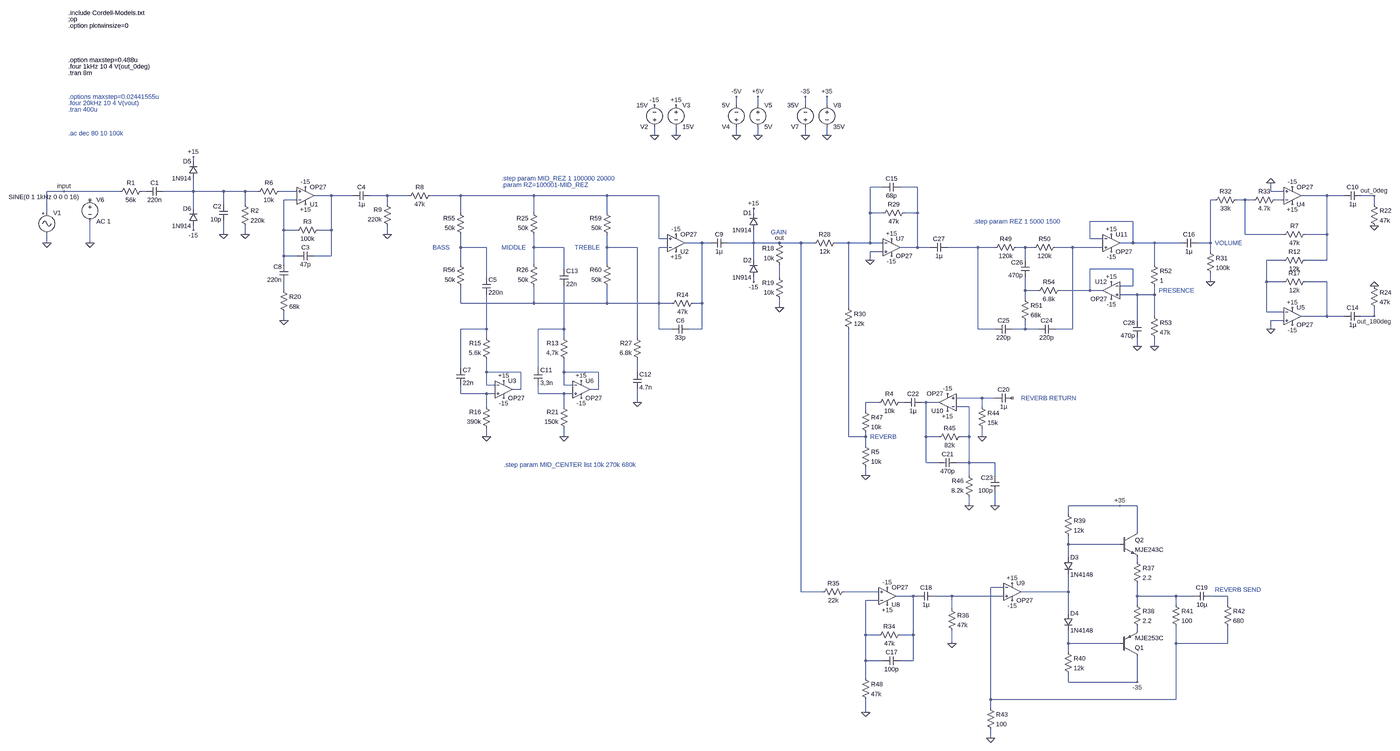
[diagram p0: schematic jazz_preamp.asc, whole sheet]
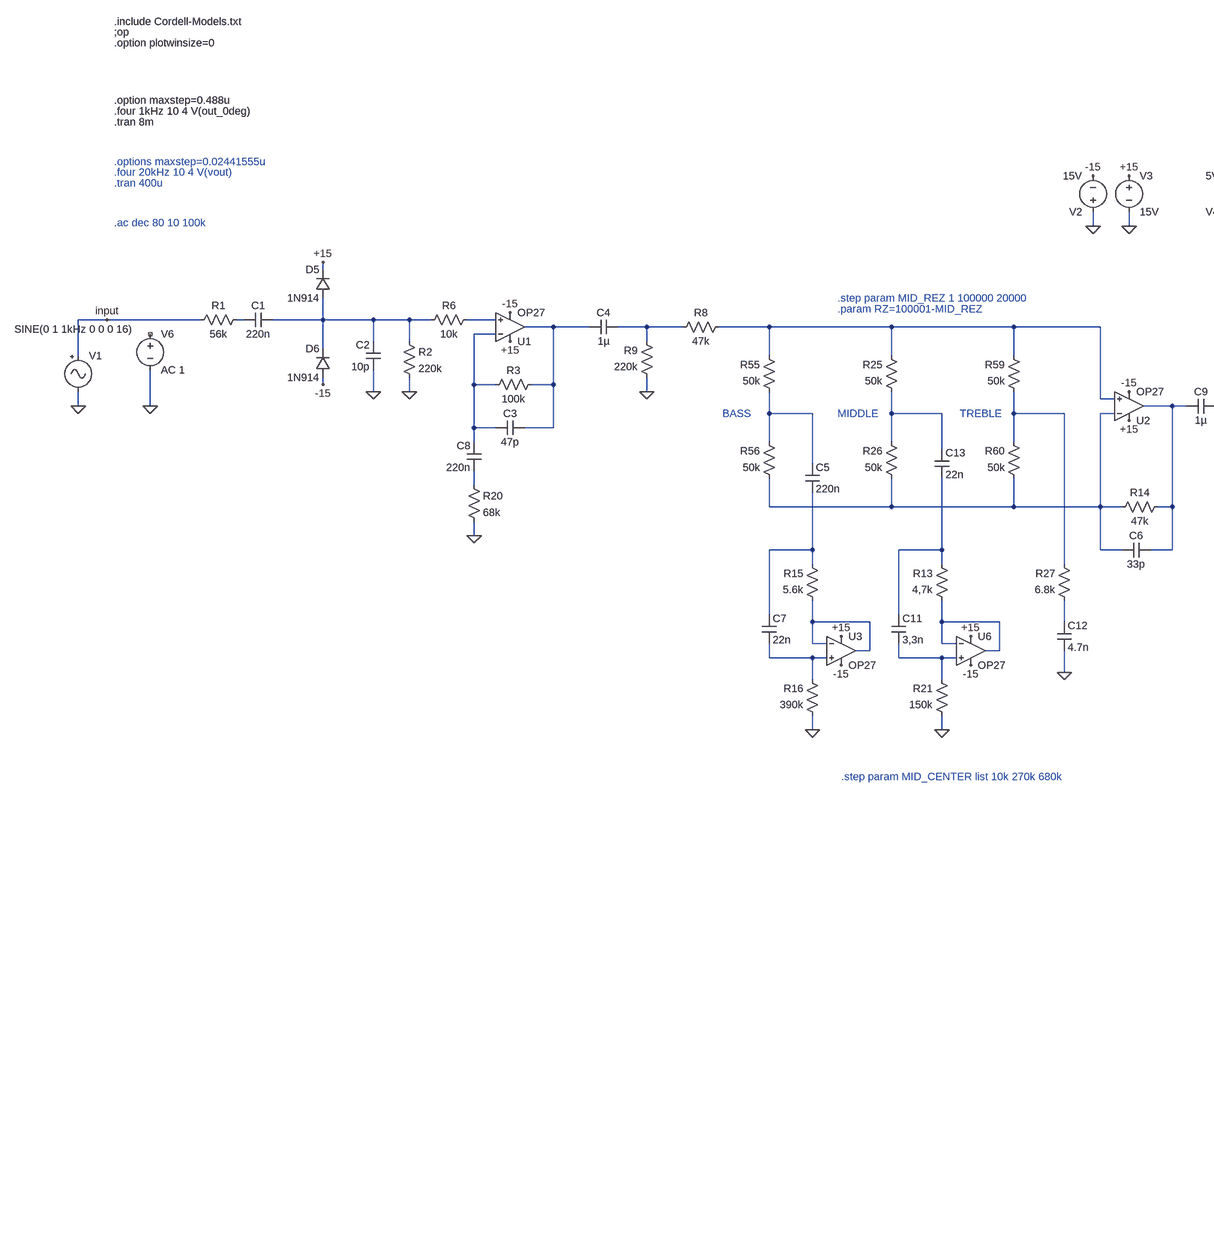
[diagram p1: schematic jazz_preamp.asc, part, row 1 of 1, column 1 of 2]
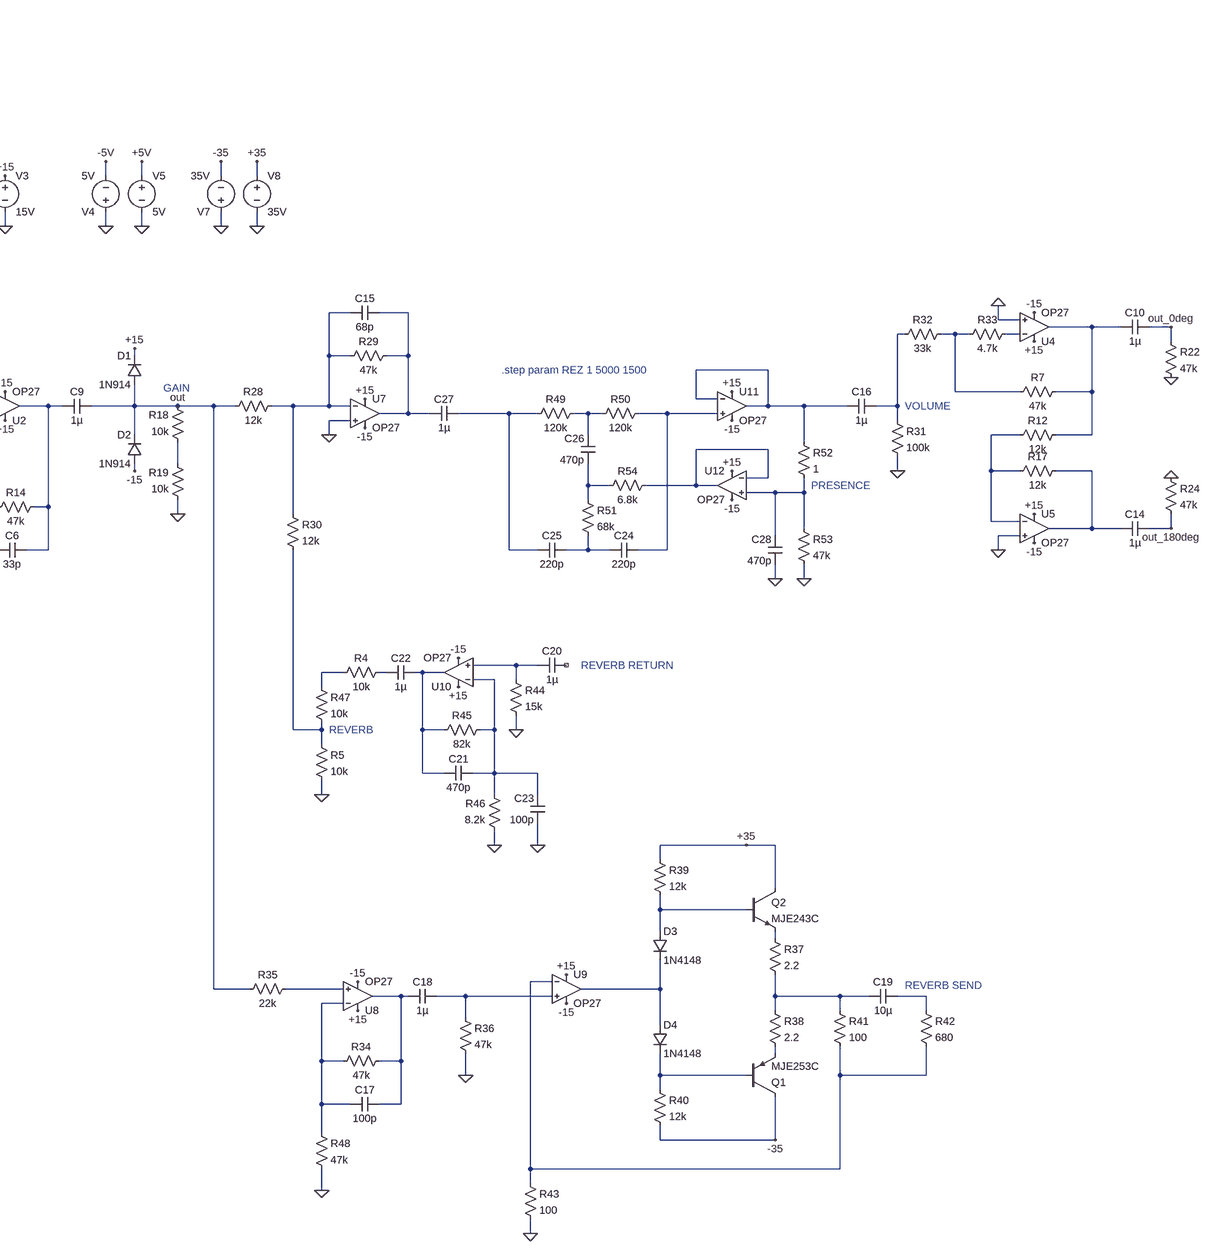
[diagram p2: schematic jazz_preamp.asc, part, row 1 of 1, column 2 of 2]
jazz_preamp.asc, the LTspice schematic file:
Version 4
SHEET 1 4264 1972
WIRE 1392 -656 1392 -688
WIRE 1472 -656 1472 -688
WIRE 1648 -656 1648 -688
WIRE 1728 -656 1728 -688
WIRE 1088 -544 1088 -576
WIRE 1168 -544 1168 -576
WIRE 1392 -544 1392 -576
WIRE 1472 -544 1472 -576
WIRE 1648 -544 1648 -576
WIRE 1728 -544 1728 -576
WIRE -624 -448 -624 -464
WIRE 1936 -352 1888 -352
WIRE 2064 -352 2000 -352
WIRE -1104 -336 -1168 -336
WIRE -896 -336 -1104 -336
WIRE -800 -336 -816 -336
WIRE -624 -336 -624 -384
WIRE -624 -336 -736 -336
WIRE -512 -336 -624 -336
WIRE -432 -336 -512 -336
WIRE -384 -336 -432 -336
WIRE -240 -336 -304 -336
WIRE 3376 -336 3376 -368
WIRE 3424 -336 3376 -336
WIRE -112 -320 -176 -320
WIRE -32 -320 -112 -320
WIRE 96 -320 32 -320
WIRE 176 -320 96 -320
WIRE 368 -320 256 -320
WIRE 640 -320 368 -320
WIRE 912 -320 640 -320
WIRE 1104 -320 912 -320
WIRE 3584 -320 3488 -320
WIRE 3648 -320 3584 -320
WIRE 3760 -320 3712 -320
WIRE -240 -304 -288 -304
WIRE 3168 -304 3152 -304
WIRE 3280 -304 3248 -304
WIRE 3312 -304 3280 -304
WIRE 3424 -304 3392 -304
WIRE -512 -288 -512 -336
WIRE -432 -288 -432 -336
WIRE 96 -288 96 -320
WIRE 3760 -288 3760 -320
WIRE -624 -272 -624 -336
WIRE -1168 -256 -1168 -336
WIRE 368 -256 368 -320
WIRE 640 -256 640 -320
WIRE 912 -256 912 -320
WIRE 1456 -256 1456 -272
WIRE 1888 -256 1888 -352
WIRE 1936 -256 1888 -256
WIRE 2064 -256 2064 -352
WIRE 2064 -256 2016 -256
WIRE 2864 -224 2704 -224
WIRE -624 -192 -624 -208
WIRE -288 -192 -288 -304
WIRE -240 -192 -288 -192
WIRE -112 -192 -112 -320
WIRE -112 -192 -160 -192
WIRE -512 -176 -512 -224
WIRE -432 -176 -432 -208
WIRE 96 -176 96 -208
WIRE 3280 -176 3280 -304
WIRE 3424 -176 3280 -176
WIRE 3584 -176 3584 -320
WIRE 3584 -176 3504 -176
WIRE 1104 -160 1104 -320
WIRE 1136 -160 1104 -160
WIRE 2704 -160 2704 -224
WIRE 2752 -160 2704 -160
WIRE -1168 -144 -1168 -176
WIRE -1008 -144 -1008 -224
WIRE 1264 -144 1200 -144
WIRE 1296 -144 1264 -144
WIRE 1456 -144 1456 -192
WIRE 1456 -144 1360 -144
WIRE 1552 -144 1456 -144
WIRE 1632 -144 1552 -144
WIRE 1680 -144 1632 -144
WIRE 1808 -144 1760 -144
WIRE 1888 -144 1888 -256
WIRE 1888 -144 1808 -144
WIRE 1936 -144 1888 -144
WIRE 2864 -144 2864 -224
WIRE 2864 -144 2816 -144
WIRE 2944 -144 2864 -144
WIRE 3040 -144 2944 -144
WIRE 3152 -144 3152 -304
WIRE 3152 -144 3104 -144
WIRE 368 -128 368 -176
WIRE 464 -128 368 -128
WIRE 640 -128 640 -176
WIRE 752 -128 640 -128
WIRE 912 -128 912 -176
WIRE 1024 -128 912 -128
WIRE 1136 -128 1104 -128
WIRE 2064 -128 2064 -256
WIRE 2064 -128 2000 -128
WIRE 2112 -128 2064 -128
WIRE 2288 -128 2176 -128
WIRE 2352 -128 2288 -128
WIRE 2464 -128 2432 -128
WIRE 2496 -128 2464 -128
WIRE 2640 -128 2576 -128
WIRE 2752 -128 2640 -128
WIRE 1936 -112 1888 -112
WIRE 3152 -112 3152 -144
WIRE -288 -96 -288 -192
WIRE -240 -96 -288 -96
WIRE -112 -96 -112 -192
WIRE -112 -96 -176 -96
WIRE 1456 -80 1456 -144
WIRE 1888 -80 1888 -112
WIRE 2464 -80 2464 -128
WIRE 3424 -80 3360 -80
WIRE 3584 -80 3584 -176
WIRE 3584 -80 3504 -80
WIRE -288 -64 -288 -96
WIRE 368 -64 368 -128
WIRE 640 -64 640 -128
WIRE 912 -64 912 -128
WIRE 2944 -64 2944 -144
WIRE 752 -48 752 -128
WIRE 2864 -48 2704 -48
WIRE 464 -16 464 -128
WIRE 1552 -16 1552 -64
WIRE 1456 0 1456 -16
WIRE 3152 0 3152 -32
WIRE 3360 0 3360 -80
WIRE 3424 0 3360 0
WIRE 3584 0 3504 0
WIRE 2864 16 2864 -48
WIRE 2864 16 2816 16
WIRE -288 32 -288 0
WIRE 2464 32 2464 -16
WIRE 2512 32 2464 32
WIRE 2704 32 2704 -48
WIRE 2704 32 2592 32
WIRE 2752 32 2704 32
WIRE 2880 48 2816 48
WIRE 2944 48 2944 16
WIRE 2944 48 2880 48
WIRE 2464 64 2464 32
WIRE 368 80 368 16
WIRE 640 80 640 16
WIRE 640 80 368 80
WIRE 912 80 912 16
WIRE 912 80 640 80
WIRE 1104 80 1104 -128
WIRE 1104 80 912 80
WIRE 1152 80 1104 80
WIRE 1264 80 1264 -144
WIRE 1264 80 1232 80
WIRE 1552 96 1552 64
WIRE 1808 96 1808 -144
WIRE 3360 112 3360 0
WIRE 3424 112 3360 112
WIRE 2944 128 2944 48
WIRE 3584 128 3584 0
WIRE 3584 128 3488 128
WIRE 3648 128 3584 128
WIRE 3760 128 3760 96
WIRE 3760 128 3712 128
WIRE -288 144 -288 112
WIRE 2880 144 2880 48
WIRE 3424 144 3376 144
WIRE 464 176 464 48
WIRE 464 176 368 176
WIRE 752 176 752 16
WIRE 752 176 656 176
WIRE 1104 176 1104 80
WIRE 1152 176 1104 176
WIRE 1264 176 1264 80
WIRE 1264 176 1216 176
WIRE 2288 176 2288 -128
WIRE 2352 176 2288 176
WIRE 2464 176 2464 144
WIRE 2464 176 2416 176
WIRE 2512 176 2464 176
WIRE 2640 176 2640 -128
WIRE 2640 176 2576 176
WIRE 3376 176 3376 144
WIRE 464 208 464 176
WIRE 752 208 752 176
WIRE 1024 208 1024 -128
WIRE 2880 240 2880 208
WIRE 2944 240 2944 208
WIRE 368 320 368 176
WIRE 656 320 656 176
WIRE 464 336 464 288
WIRE 592 336 464 336
WIRE 752 336 752 288
WIRE 880 336 752 336
WIRE 1024 336 1024 288
WIRE 464 384 464 336
WIRE 496 384 464 384
WIRE 752 384 752 336
WIRE 784 384 752 384
WIRE 592 400 592 336
WIRE 592 400 560 400
WIRE 880 400 880 336
WIRE 880 400 848 400
WIRE 368 416 368 384
WIRE 464 416 368 416
WIRE 496 416 464 416
WIRE 656 416 656 384
WIRE 752 416 656 416
WIRE 784 416 752 416
WIRE 2304 432 2208 432
WIRE 2352 432 2304 432
WIRE 1024 448 1024 400
WIRE 1920 448 1872 448
WIRE 2016 448 2000 448
WIRE 2096 448 2080 448
WIRE 2144 448 2096 448
WIRE 464 464 464 416
WIRE 752 464 752 416
WIRE 2256 464 2208 464
WIRE 2304 464 2304 432
WIRE 1872 480 1872 448
WIRE 464 576 464 544
WIRE 752 576 752 544
WIRE 1808 576 1808 176
WIRE 1872 576 1872 560
WIRE 1872 576 1808 576
WIRE 2096 576 2096 448
WIRE 2144 576 2096 576
WIRE 2256 576 2256 464
WIRE 2256 576 2224 576
WIRE 2304 576 2304 544
WIRE 1872 608 1872 576
WIRE 2096 672 2096 576
WIRE 2144 672 2096 672
WIRE 2256 672 2256 576
WIRE 2256 672 2208 672
WIRE 2352 672 2256 672
WIRE 1872 720 1872 688
WIRE 2256 720 2256 672
WIRE 2352 720 2352 672
WIRE 2256 832 2256 800
WIRE 2352 832 2352 784
WIRE 2816 832 2624 832
WIRE 2880 832 2816 832
WIRE 2624 864 2624 832
WIRE 2880 880 2880 832
WIRE 2880 928 2880 880
WIRE 2624 976 2624 944
WIRE 2816 976 2624 976
WIRE 2624 1024 2624 976
WIRE 2880 1040 2880 1024
WIRE 2384 1136 2336 1136
WIRE 1632 1152 1632 -144
WIRE 1712 1152 1632 1152
WIRE 1920 1152 1792 1152
WIRE 2624 1152 2624 1088
WIRE 2624 1152 2448 1152
WIRE 2048 1168 1984 1168
WIRE 2064 1168 2048 1168
WIRE 2192 1168 2128 1168
WIRE 2384 1168 2192 1168
WIRE 2880 1168 2880 1120
WIRE 3024 1168 2880 1168
WIRE 3088 1168 3024 1168
WIRE 3216 1168 3152 1168
WIRE 1920 1184 1872 1184
WIRE 2880 1200 2880 1168
WIRE 3024 1200 3024 1168
WIRE 3216 1200 3216 1168
WIRE 2192 1216 2192 1168
WIRE 2624 1232 2624 1152
WIRE 2880 1296 2880 1280
WIRE 1872 1312 1872 1184
WIRE 1920 1312 1872 1312
WIRE 2048 1312 2048 1168
WIRE 2048 1312 2000 1312
WIRE 2192 1344 2192 1296
WIRE 2624 1344 2624 1296
WIRE 2816 1344 2624 1344
WIRE 3024 1344 3024 1280
WIRE 3216 1344 3216 1280
WIRE 3216 1344 3024 1344
WIRE 2624 1376 2624 1344
WIRE 1872 1408 1872 1312
WIRE 1936 1408 1872 1408
WIRE 2048 1408 2048 1312
WIRE 2048 1408 2000 1408
WIRE 1872 1472 1872 1408
WIRE 2624 1488 2624 1456
WIRE 2880 1488 2880 1392
WIRE 2880 1488 2624 1488
WIRE 2336 1552 2336 1136
WIRE 3024 1552 3024 1344
WIRE 3024 1552 2336 1552
WIRE 2336 1584 2336 1552
WIRE 1872 1600 1872 1552
WIRE 2336 1696 2336 1664
FLAG -1168 -144 0
FLAG -432 -176 0
FLAG -512 -176 0
FLAG 1552 96 0
FLAG -288 144 0
FLAG 1088 -544 0
FLAG 1168 -544 0
FLAG -1008 -144 0
FLAG 1552 -144 out
FLAG 96 -176 0
FLAG 464 576 0
FLAG 1024 448 0
FLAG 1088 -656 -15
FLAG 1168 -656 +15
FLAG 528 368 +15
FLAG 1168 -112 +15
FLAG 528 432 -15
FLAG 1168 -176 -15
FLAG 752 576 0
FLAG 816 368 +15
FLAG 816 432 -15
FLAG 1472 -544 0
FLAG 1392 -544 0
FLAG 1472 -688 +5V
FLAG 1392 -688 -5V
FLAG 3456 -288 +15
FLAG 3456 -352 -15
FLAG 3376 -368 0
FLAG 3456 96 +15
FLAG 3456 160 -15
FLAG 3376 176 0
FLAG 3760 -208 0
FLAG 3760 16 0
FLAG 1968 -160 +15
FLAG 1968 -96 -15
FLAG 1888 -80 0
FLAG 3152 0 0
FLAG -208 -288 +15
FLAG -208 -352 -15
FLAG 1952 1200 +15
FLAG 1952 1136 -15
FLAG 2192 1344 0
FLAG 2416 1184 -15
FLAG 2416 1120 +15
FLAG 2336 1696 0
FLAG 1728 -544 0
FLAG 1648 -544 0
FLAG 1648 -688 -35
FLAG 1728 -688 +35
FLAG 2816 832 +35
FLAG 2880 1488 -35
FLAG 2176 480 +15
FLAG 2176 416 -15
FLAG 2304 576 0
FLAG 2256 832 0
FLAG 1872 720 0
FLAG 2352 832 0
FLAG 1872 1600 0
FLAG 2784 -176 +15
FLAG 2784 0 +15
FLAG 2784 64 -15
FLAG 2784 -112 -15
FLAG 2944 240 0
FLAG -624 -464 +15
FLAG -624 -192 -15
FLAG 1456 -272 +15
FLAG 1456 0 -15
FLAG 2880 240 0
FLAG 3760 128 out_180deg
FLAG 3760 -320 out_0deg
FLAG -1104 -336 input
DATAFLAG 2880 880 "Ic(Q2)"
SYMBOL Misc\\signal -1168 -272 R0
WINDOW 3 -142 -43 Left 2
WINDOW 123 0 0 Left 2
WINDOW 39 0 0 Left 2
SYMATTR Value SINE(0 1 1kHz 0 0 0 16)
SYMATTR InstName V1
SYMBOL res -912 -320 R270
WINDOW 0 32 56 VTop 2
WINDOW 3 0 56 VBottom 2
SYMATTR InstName R1
SYMATTR Value 56k
SYMBOL Opamps\\OP27 -208 -256 M180
SYMATTR InstName U1
SYMBOL cap -736 -352 R90
WINDOW 0 0 32 VBottom 2
WINDOW 3 32 32 VTop 2
SYMATTR InstName C1
SYMATTR Value 220n
SYMBOL cap -496 -224 R180
WINDOW 0 24 56 Left 2
WINDOW 3 24 8 Left 2
SYMATTR InstName C2
SYMATTR Value 10p
SYMBOL res -448 -304 R0
SYMATTR InstName R2
SYMATTR Value 220k
SYMBOL res -144 -208 R90
WINDOW 0 0 56 VBottom 2
WINDOW 3 32 56 VTop 2
SYMATTR InstName R3
SYMATTR Value 100k
SYMBOL cap -176 -112 R90
WINDOW 0 0 32 VBottom 2
WINDOW 3 32 32 VTop 2
SYMATTR InstName C3
SYMATTR Value 47p
SYMBOL cap 32 -336 R90
WINDOW 0 0 32 VBottom 2
WINDOW 3 32 32 VTop 2
SYMATTR InstName C4
SYMATTR Value 1µ
SYMBOL cap 448 -16 R0
SYMATTR InstName C5
SYMATTR Value 220n
SYMBOL cap 1360 -160 R90
WINDOW 0 0 32 VBottom 2
WINDOW 3 32 32 VTop 2
SYMATTR InstName C9
SYMATTR Value 1µ
SYMBOL res 1568 -48 R180
WINDOW 0 36 76 Left 2
WINDOW 3 36 40 Left 2
SYMATTR InstName R18
SYMATTR Value 10k
SYMBOL res 1568 80 R180
WINDOW 0 36 76 Left 2
WINDOW 3 36 40 Left 2
SYMATTR InstName R19
SYMATTR Value 10k
SYMBOL res -304 16 R0
SYMATTR InstName R20
SYMATTR Value 68k
SYMBOL voltage 1088 -560 R180
WINDOW 123 0 0 Left 2
WINDOW 39 0 0 Left 2
SYMATTR InstName V2
SYMATTR Value 15V
SYMBOL voltage 1168 -672 R0
WINDOW 123 0 0 Left 2
WINDOW 39 0 0 Left 2
SYMATTR InstName V3
SYMATTR Value 15V
SYMBOL voltage -1008 -320 R0
WINDOW 123 0 0 Left 2
WINDOW 39 0 0 Left 2
SYMATTR InstName V6
SYMATTR Value AC 1
SYMBOL res 272 -336 R90
WINDOW 0 0 56 VBottom 2
WINDOW 3 32 56 VTop 2
SYMATTR InstName R8
SYMATTR Value 47k
SYMBOL res 112 -192 R180
WINDOW 0 36 76 Left 2
WINDOW 3 36 40 Left 2
SYMATTR InstName R9
SYMATTR Value 220k
SYMBOL res 1248 64 R90
WINDOW 0 0 56 VBottom 2
WINDOW 3 32 56 VTop 2
SYMATTR InstName R14
SYMATTR Value 47k
SYMBOL cap 1216 160 R90
WINDOW 0 0 32 VBottom 2
WINDOW 3 32 32 VTop 2
SYMATTR InstName C6
SYMATTR Value 33p
SYMBOL Opamps\\OP27 1168 -80 M180
SYMATTR InstName U2
SYMBOL Opamps\\OP27 528 336 R0
SYMATTR InstName U3
SYMBOL res 480 304 R180
WINDOW 0 36 76 Left 2
WINDOW 3 36 40 Left 2
SYMATTR InstName R15
SYMATTR Value 5.6k
SYMBOL res 480 560 R180
WINDOW 0 36 76 Left 2
WINDOW 3 36 40 Left 2
SYMATTR InstName R16
SYMATTR Value 390k
SYMBOL cap 352 320 R0
SYMATTR InstName C7
SYMATTR Value 22n
SYMBOL res 1040 304 R180
WINDOW 0 36 76 Left 2
WINDOW 3 36 40 Left 2
SYMATTR InstName R27
SYMATTR Value 6.8k
SYMBOL cap 1008 336 R0
SYMATTR InstName C12
SYMATTR Value 4.7n
SYMBOL Opamps\\OP27 816 336 R0
SYMATTR InstName U6
SYMBOL res 768 304 R180
WINDOW 0 36 76 Left 2
WINDOW 3 36 40 Left 2
SYMATTR InstName R13
SYMATTR Value 4,7k
SYMBOL res 768 560 R180
WINDOW 0 36 76 Left 2
WINDOW 3 36 40 Left 2
SYMATTR InstName R21
SYMATTR Value 150k
SYMBOL cap 640 320 R0
SYMATTR InstName C11
SYMATTR Value 3,3n
SYMBOL cap 736 -48 R0
SYMATTR InstName C13
SYMATTR Value 22n
SYMBOL res -288 -352 R90
WINDOW 0 0 56 VBottom 2
WINDOW 3 32 56 VTop 2
SYMATTR InstName R6
SYMATTR Value 10k
SYMBOL cap -272 0 R180
WINDOW 0 24 56 Left 2
WINDOW 3 24 8 Left 2
SYMATTR InstName C8
SYMATTR Value 220n
SYMBOL voltage 1392 -560 R180
WINDOW 123 0 0 Left 2
WINDOW 39 0 0 Left 2
SYMATTR InstName V4
SYMATTR Value 5V
SYMBOL voltage 1472 -672 R0
WINDOW 123 0 0 Left 2
WINDOW 39 0 0 Left 2
SYMATTR InstName V5
SYMATTR Value 5V
SYMBOL Opamps\\OP27 3456 -256 M180
SYMATTR InstName U4
SYMBOL res 3408 -160 R270
WINDOW 0 32 56 VTop 2
WINDOW 3 0 56 VBottom 2
SYMATTR InstName R7
SYMATTR Value 47k
SYMBOL Opamps\\OP27 3456 64 R0
SYMATTR InstName U5
SYMBOL res 3408 -64 R270
WINDOW 0 32 56 VTop 2
WINDOW 3 0 56 VBottom 2
SYMATTR InstName R12
SYMATTR Value 12k
SYMBOL res 3408 16 R270
WINDOW 0 32 56 VTop 2
WINDOW 3 0 56 VBottom 2
SYMATTR InstName R17
SYMATTR Value 12k
SYMBOL cap 3712 -336 R90
WINDOW 0 0 32 VBottom 2
WINDOW 3 32 32 VTop 2
SYMATTR InstName C10
SYMATTR Value 1µ
SYMBOL cap 3712 112 R90
WINDOW 0 0 32 VBottom 2
WINDOW 3 32 32 VTop 2
SYMATTR InstName C14
SYMATTR Value 1µ
SYMBOL res 3744 -304 R0
SYMATTR InstName R22
SYMATTR Value 47k
SYMBOL res 3744 0 R0
SYMATTR InstName R24
SYMATTR Value 47k
SYMBOL res 1664 -128 R270
WINDOW 0 32 56 VTop 2
WINDOW 3 0 56 VBottom 2
SYMATTR InstName R28
SYMATTR Value 12k
SYMBOL Opamps\\OP27 1968 -192 R0
SYMATTR InstName U7
SYMBOL res 1920 -240 R270
WINDOW 0 32 56 VTop 2
WINDOW 3 0 56 VBottom 2
SYMATTR InstName R29
SYMATTR Value 47k
SYMBOL cap 2000 -368 R90
WINDOW 0 0 32 VBottom 2
WINDOW 3 32 32 VTop 2
SYMATTR InstName C15
SYMATTR Value 68p
SYMBOL res 1792 80 R0
SYMATTR InstName R30
SYMATTR Value 12k
SYMBOL cap 3104 -160 R90
WINDOW 0 0 32 VBottom 2
WINDOW 3 32 32 VTop 2
SYMATTR InstName C16
SYMATTR Value 1µ
SYMBOL res 3136 -128 R0
SYMATTR InstName R31
SYMATTR Value 100k
SYMBOL res 3152 -288 R270
WINDOW 0 32 56 VTop 2
WINDOW 3 0 56 VBottom 2
SYMATTR InstName R32
SYMATTR Value 33k
SYMBOL res 3296 -288 R270
WINDOW 0 32 56 VTop 2
WINDOW 3 0 56 VBottom 2
SYMATTR InstName R33
SYMATTR Value 4.7k
SYMBOL Opamps\\OP27 1952 1232 M180
SYMATTR InstName U8
SYMBOL res 2016 1296 R90
WINDOW 0 0 56 VBottom 2
WINDOW 3 32 56 VTop 2
SYMATTR InstName R34
SYMATTR Value 47k
SYMBOL cap 1936 1424 R270
WINDOW 0 32 32 VTop 2
WINDOW 3 0 32 VBottom 2
SYMATTR InstName C17
SYMATTR Value 100p
SYMBOL Opamps\\OP27 2416 1088 R0
SYMATTR InstName U9
SYMBOL res 1696 1168 R270
WINDOW 0 32 56 VTop 2
WINDOW 3 0 56 VBottom 2
SYMATTR InstName R35
SYMATTR Value 22k
SYMBOL cap 2128 1152 R90
WINDOW 0 0 32 VBottom 2
WINDOW 3 32 32 VTop 2
SYMATTR InstName C18
SYMATTR Value 1µ
SYMBOL res 2176 1200 R0
SYMATTR InstName R36
SYMATTR Value 47k
SYMBOL diode 2608 1024 R0
SYMATTR InstName D3
SYMATTR Value 1N4148
SYMBOL diode 2608 1232 R0
SYMATTR InstName D4
SYMATTR Value 1N4148
SYMBOL pnp 2816 1392 M180
SYMATTR InstName Q1
SYMATTR Value MJE253C
SYMBOL npn 2816 928 R0
SYMATTR InstName Q2
SYMATTR Value MJE243C
SYMBOL res 2864 1024 R0
SYMATTR InstName R37
SYMATTR Value 2.2
SYMBOL res 2864 1184 R0
SYMATTR InstName R38
SYMATTR Value 2.2
SYMBOL res 2608 848 R0
SYMATTR InstName R39
SYMATTR Value 12k
SYMBOL res 2608 1360 R0
SYMATTR InstName R40
SYMATTR Value 12k
SYMBOL res 3008 1184 R0
SYMATTR InstName R41
SYMATTR Value 100
SYMBOL cap 3152 1152 R90
WINDOW 0 0 32 VBottom 2
WINDOW 3 32 32 VTop 2
SYMATTR InstName C19
SYMATTR Value 10µ
SYMBOL res 3200 1184 R0
SYMATTR InstName R42
SYMATTR Value 680
SYMBOL res 2320 1568 R0
SYMATTR InstName R43
SYMATTR Value 100
SYMBOL voltage 1648 -560 R180
WINDOW 123 0 0 Left 2
WINDOW 39 0 0 Left 2
SYMATTR InstName V7
SYMATTR Value 35V
SYMBOL voltage 1728 -672 R0
WINDOW 123 0 0 Left 2
WINDOW 39 0 0 Left 2
SYMATTR InstName V8
SYMATTR Value 35V
SYMBOL Opamps\\OP27 2176 512 R180
SYMATTR InstName U10
SYMBOL res 2288 448 R0
SYMATTR InstName R44
SYMATTR Value 15k
SYMBOL cap 2416 416 R90
WINDOW 0 0 32 VBottom 2
WINDOW 3 32 32 VTop 2
SYMATTR InstName C20
SYMATTR Value 1µ
SYMBOL res 2240 560 R90
WINDOW 0 0 56 VBottom 2
WINDOW 3 32 56 VTop 2
SYMATTR InstName R45
SYMATTR Value 82k
SYMBOL cap 2208 656 R90
WINDOW 0 0 32 VBottom 2
WINDOW 3 32 32 VTop 2
SYMATTR InstName C21
SYMATTR Value 470p
SYMBOL res 2272 816 R180
WINDOW 0 36 76 Left 2
WINDOW 3 36 40 Left 2
SYMATTR InstName R46
SYMATTR Value 8.2k
SYMBOL cap 2080 432 R90
WINDOW 0 0 32 VBottom 2
WINDOW 3 32 32 VTop 2
SYMATTR InstName C22
SYMATTR Value 1µ
SYMBOL res 1856 464 R0
SYMATTR InstName R47
SYMATTR Value 10k
SYMBOL cap 2368 784 R180
WINDOW 0 24 56 Left 2
WINDOW 3 24 8 Left 2
SYMATTR InstName C23
SYMATTR Value 100p
SYMBOL diode -608 -384 R180
WINDOW 0 24 64 Left 2
WINDOW 3 24 0 Left 2
SYMATTR InstName D5
SYMATTR Value 1N914
SYMBOL diode -608 -208 R180
WINDOW 0 24 64 Left 2
WINDOW 3 24 0 Left 2
SYMATTR InstName D6
SYMATTR Value 1N914
SYMBOL res 1856 1456 R0
SYMATTR InstName R48
SYMATTR Value 47k
SYMBOL Opamps\\OP27 2784 -208 R0
SYMATTR InstName U11
SYMBOL Opamps\\OP27 2784 -32 M0
SYMATTR InstName U12
SYMBOL res 2336 -112 R270
WINDOW 0 32 56 VTop 2
WINDOW 3 0 56 VBottom 2
SYMATTR InstName R49
SYMATTR Value 120k
SYMBOL res 2480 -112 R270
WINDOW 0 32 56 VTop 2
WINDOW 3 0 56 VBottom 2
SYMATTR InstName R50
SYMATTR Value 120k
SYMBOL cap 2576 160 R90
WINDOW 0 0 32 VBottom 2
WINDOW 3 32 32 VTop 2
SYMATTR InstName C24
SYMATTR Value 220p
SYMBOL cap 2416 160 R90
WINDOW 0 0 32 VBottom 2
WINDOW 3 32 32 VTop 2
SYMATTR InstName C25
SYMATTR Value 220p
SYMBOL cap 2176 -144 R90
WINDOW 0 0 32 VBottom 2
WINDOW 3 32 32 VTop 2
SYMATTR InstName C27
SYMATTR Value 1µ
SYMBOL res 2928 -80 R0
SYMATTR InstName R52
SYMATTR Value 1
SYMBOL res 2928 112 R0
SYMATTR InstName R53
SYMATTR Value 47k
SYMBOL res 2496 48 R270
WINDOW 0 32 56 VTop 2
WINDOW 3 0 56 VBottom 2
SYMATTR InstName R54
SYMATTR Value 6.8k
SYMBOL cap 2480 -16 R180
WINDOW 0 24 56 Left 2
WINDOW 3 24 8 Left 2
SYMATTR InstName C26
SYMATTR Value 470p
SYMBOL res 2448 48 R0
SYMATTR InstName R51
SYMATTR Value 68k
SYMBOL diode 1472 -192 R180
WINDOW 0 24 64 Left 2
WINDOW 3 24 0 Left 2
SYMATTR InstName D1
SYMATTR Value 1N914
SYMBOL diode 1472 -16 R180
WINDOW 0 24 64 Left 2
WINDOW 3 24 0 Left 2
SYMATTR InstName D2
SYMATTR Value 1N914
SYMBOL cap 2896 208 R180
WINDOW 0 24 56 Left 2
WINDOW 3 24 8 Left 2
SYMATTR InstName C28
SYMATTR Value 470p
SYMBOL res 384 -160 R180
WINDOW 0 36 76 Left 2
WINDOW 3 36 40 Left 2
SYMATTR InstName R55
SYMATTR Value 50k
SYMBOL res 384 32 R180
WINDOW 0 36 76 Left 2
WINDOW 3 36 40 Left 2
SYMATTR InstName R56
SYMATTR Value 50k
SYMBOL res 656 -160 R180
WINDOW 0 36 76 Left 2
WINDOW 3 36 40 Left 2
SYMATTR InstName R25
SYMATTR Value 50k
SYMBOL res 656 32 R180
WINDOW 0 36 76 Left 2
WINDOW 3 36 40 Left 2
SYMATTR InstName R26
SYMATTR Value 50k
SYMBOL res 928 -160 R180
WINDOW 0 36 76 Left 2
WINDOW 3 36 40 Left 2
SYMATTR InstName R59
SYMATTR Value 50k
SYMBOL res 928 32 R180
WINDOW 0 36 76 Left 2
WINDOW 3 36 40 Left 2
SYMATTR InstName R60
SYMATTR Value 50k
SYMBOL res 2016 432 R90
WINDOW 0 0 56 VBottom 2
WINDOW 3 32 56 VTop 2
SYMATTR InstName R4
SYMATTR Value 10k
SYMBOL res 1856 592 R0
SYMATTR InstName R5
SYMATTR Value 10k
TEXT -1088 -1008 Left 2 !.include Cordell-Models.txt
TEXT -1088 -984 Left 2 !;op
TEXT -1088 -776 Left 2 !.tran 8m
TEXT -1088 -960 Left 2 !.option plotwinsize=0
TEXT -1088 -824 Left 2 !.option maxstep=0.488u
TEXT -1088 -664 Left 2 ;.four 20kHz 10 4 V(vout)
TEXT -1088 -688 Left 2 ;.options maxstep=0.02441555u
TEXT -1088 -800 Left 2 !.four 1kHz 10 4 V(out_0deg)
TEXT -1088 -640 Left 2 ;.tran 400u
TEXT -1088 -552 Left 2 ;.ac dec 80 10 100k
TEXT 2272 -224 Left 2 ;.step param REZ 1 5000 1500
TEXT 520 -384 Left 2 ;.step param MID_REZ 1 100000 20000
TEXT 520 -360 Left 2 ;.param RZ=100001-MID_REZ
TEXT 528 680 Left 2 ;.step param MID_CENTER list 10k 270k 680k
TEXT 264 -128 Left 2 ;BASS
TEXT 520 -128 Left 2 ;MIDDLE
TEXT 792 -128 Left 2 ;TREBLE
TEXT 2960 32 Left 2 ;PRESENCE
TEXT 1520 -184 Left 2 ;GAIN
TEXT 3168 -144 Left 2 ;VOLUME
TEXT 1888 576 Left 2 ;REVERB
TEXT 2448 432 Left 2 ;REVERB RETURN
TEXT 3168 1144 Left 2 ;REVERB SEND

The netlist it stands for:
* jazz_preamp.asc
V1 input 0 SINE(0 1 1kHz 0 0 0 16)
R1 input N003 56k
XU1 N005 N010 +15 -15 N006 OP27  ; pins In+ In- V+ V- OUT
C1 N004 N003 220n
C2 0 N004 10p
R2 N004 0 220k
R3 N006 N010 100k
C3 N006 N010 47p
C4 N007 N006 1µ
C5 N016 N030 220n
C9 out N015 1µ
R18 N025 out 10k
R19 0 N025 10k
R20 N027 0 68k
V2 0 -15 15V
V3 +15 0 15V
V6 NC_01 0 AC 1
R8 N008 N007 47k
R9 0 N007 220k
R14 N015 N019 47k
C6 N015 N019 33p
XU2 N008 N019 +15 -15 N015 OP27  ; pins In+ In- V+ V- OUT
XU3 N036 N033 +15 -15 N033 OP27  ; pins In+ In- V+ V- OUT
R15 N033 N030 5.6k
R16 0 N036 390k
C7 N030 N036 22n
R27 N035 N018 6.8k
C12 N035 0 4.7n
XU6 N037 N034 +15 -15 N034 OP27  ; pins In+ In- V+ V- OUT
R13 N034 N031 4,7k
R21 0 N037 150k
C11 N031 N037 3,3n
C13 N017 N031 22n
R6 N005 N004 10k
C8 N027 N010 220n
V4 0 -5V 5V
V5 +5V 0 5V
XU4 0 N013 +15 -15 N009 OP27  ; pins In+ In- V+ V- OUT
R7 N012 N009 47k
XU5 0 N023 +15 -15 N026 OP27  ; pins In+ In- V+ V- OUT
R12 N023 N009 12k
R17 N023 N026 12k
C10 out_0deg N009 1µ
C14 out_180deg N026 1µ
R22 out_0deg 0 47k
R24 0 out_180deg 47k
R28 out N001 12k
XU7 0 N001 +15 -15 N002 OP27  ; pins In+ In- V+ V- OUT
R29 N001 N002 47k
C15 N002 N001 68p
R30 N001 N043 12k
C16 N011 N014 1µ
R31 N011 0 100k
R32 N011 N012 33k
R33 N012 N013 4.7k
XU8 N047 N053 +15 -15 N049 OP27  ; pins In+ In- V+ V- OUT
R34 N049 N053 47k
C17 N053 N049 100p
XU9 N050 N046 +15 -15 N048 OP27  ; pins In+ In- V+ V- OUT
R35 out N047 22k
C18 N050 N049 1µ
R36 N050 0 47k
D3 N044 N048 1N4148
D4 N048 N055 1N4148
Q1 -35 N055 N054 0 MJE253C
Q2 +35 N044 N045 0 MJE243C
R37 N045 N051 2.2
R38 N051 N054 2.2
R39 +35 N044 12k
R40 N055 -35 12k
R41 N051 N046 100
C19 N052 N051 10µ
R42 N052 N046 680
R43 N046 0 100
V7 0 -35 35V
V8 +35 0 35V
XU10 N038 N042 +15 -15 N041 OP27  ; pins In+ In- V+ V- OUT
R44 N038 0 15k
C20 NC_02 N038 1µ
R45 N042 N041 82k
C21 N042 N041 470p
R46 0 N042 8.2k
C22 N041 N040 1µ
R47 N039 N043 10k
C23 0 N042 100p
D5 N004 +15 1N914
D6 -15 N004 1N914
R48 N053 0 47k
XU11 N022 N014 +15 -15 N014 OP27  ; pins In+ In- V+ V- OUT
XU12 N029 N024 +15 -15 N024 OP27  ; pins In+ In- V+ V- OUT
R49 N020 N021 120k
R50 N021 N022 120k
C24 N022 N032 220p
C25 N032 N020 220p
C27 N020 N002 1µ
R52 N014 N029 1
R53 N029 0 47k
R54 N028 N024 6.8k
C26 N028 N021 470p
R51 N028 N032 68k
D1 out +15 1N914
D2 -15 out 1N914
C28 0 N029 470p
R55 N016 N008 50k
R56 N019 N016 50k
R25 N017 N008 50k
R26 N019 N017 50k
R59 N018 N008 50k
R60 N019 N018 50k
R4 N040 N039 10k
R5 N043 0 10k
.model D D
.lib standard.dio
.model NPN NPN
.model PNP PNP
.lib standard.bjt
.include Cordell-Models.txt
;op
.tran 8m
.option plotwinsize=0
.option maxstep=0.488u
* .four 20kHz 10 4 V(vout)
* .options maxstep=0.02441555u
.four 1kHz 10 4 V(out_0deg)
* .tran 400u
* .ac dec 80 10 100k
* .step param REZ 1 5000 1500
* .step param MID_REZ 1 100000 20000
* .param RZ=100001-MID_REZ
* .step param MID_CENTER list 10k 270k 680k
* BASS
* MIDDLE
* TREBLE
* PRESENCE
* GAIN
* VOLUME
* REVERB
* REVERB RETURN
* REVERB SEND
.lib ADI.lib
.backanno
.end